# EAGLE design GBz (EAGLE 7.7.0)
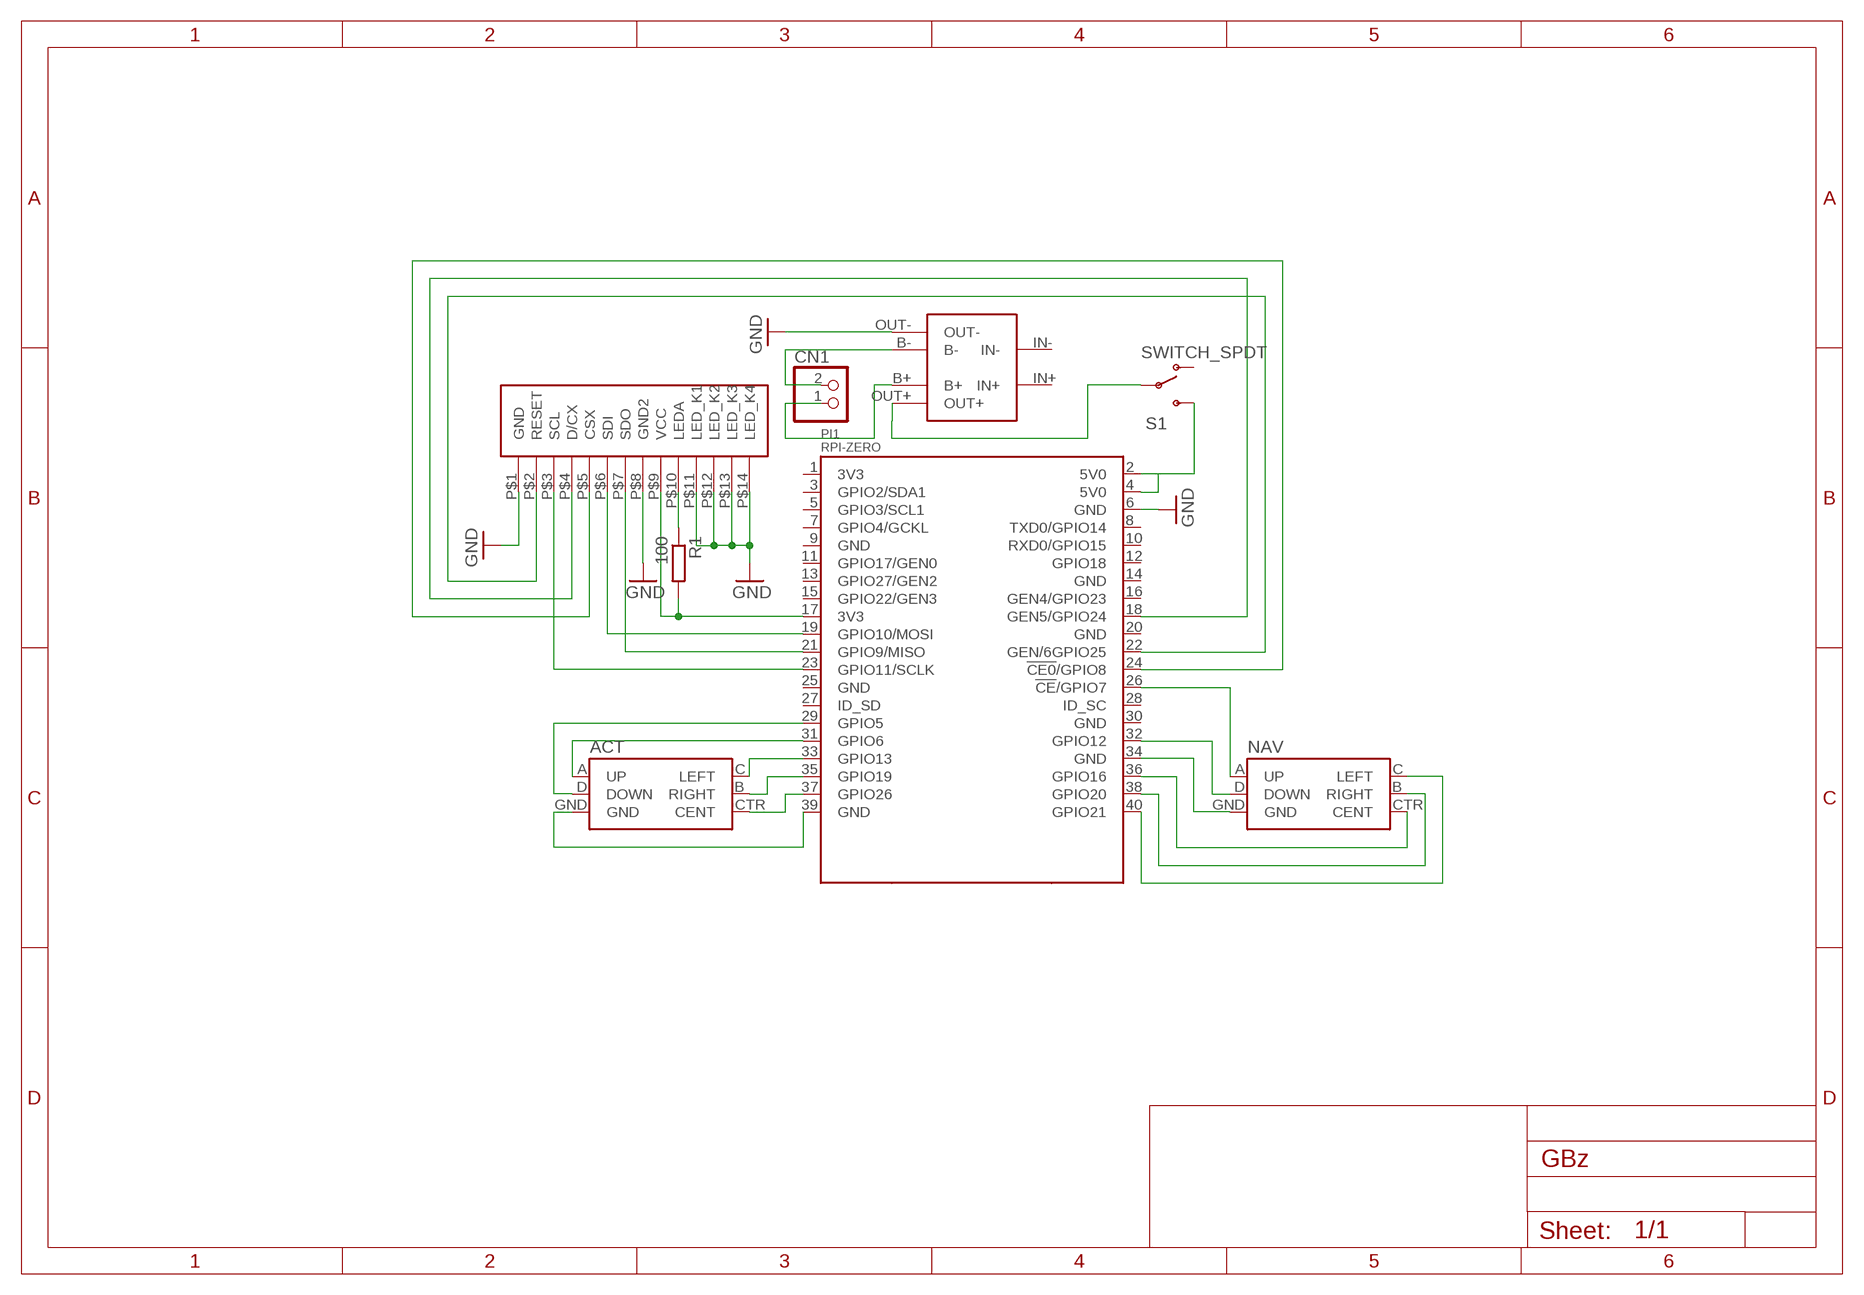
[diagram p0: schematic, sheet 1]

## Parts
ACT  JOYSTICK_MINI  [JOYSTICK_MINI]
CN1  JST_2PIN-SMT-RA  [JST-PH-2-SMT-RA]
NAV  JOYSTICK_MINI  [JOYSTICK_MINI]
PI1  RPI-ZERO  [RASPBERRYPI_BASTELSTUBE_V13_RASPI_BOARD_B+_FULL]
POWER1  03962A  [03962A]
R1  100  R-EU_R0805  [R0805]
S1  SWITCH_SPDT  [KPS-1290]
SCREEN1  ILI9341-2.2  [ILI9341-2.2]

## Nets
5V0@2: PI1.2(5V0) PI1.4(5V0) S1.S
GND: PI1.6(GND) POWER1.OUT- SCREEN1.P$1(GND) SCREEN1.P$8(GND2) SCREEN1.P$11(LED_K1) SCREEN1.P$12(LED_K2) SCREEN1.P$13(LED_K3) SCREEN1.P$14(LED_K4)
GND@3: ACT.GND PI1.39(GND)
GND@7: NAV.GND PI1.34(GND)
N$1: PI1.22(GEN/6GPIO25) SCREEN1.P$2(RESET)
N$2: PI1.23(GPIO11/SCLK) SCREEN1.P$3(SCL)
N$3: PI1.19(GPIO10/MOSI) SCREEN1.P$6(SDI)
N$4: PI1.21(GPIO9/MISO) SCREEN1.P$7(SDO)
N$5: R1.1 SCREEN1.P$10(LEDA)
N$6: PI1.18(GEN5/GPIO24) SCREEN1.P$4(D/CX)
N$7: PI1.24(!CE0!/GPIO8) SCREEN1.P$5(CSX)
N$8: NAV.CTR(CENT) PI1.36(GPIO16)
N$9: ACT.CTR(CENT) PI1.37(GPIO26)
N$10: ACT.B(RIGHT) PI1.35(GPIO19)
N$11: ACT.C(LEFT) PI1.33(GPIO13)
N$12: ACT.A(UP) PI1.31(GPIO6)
N$13: ACT.D(DOWN) PI1.29(GPIO5)
N$14: NAV.B(RIGHT) PI1.38(GPIO20)
N$15: NAV.C(LEFT) PI1.40(GPIO21)
N$16: CN1.1 POWER1.B+
N$17: NAV.D(DOWN) PI1.32(GPIO12)
N$18: NAV.A(UP) PI1.26(!CE!/GPIO7)
N$19: PI1.17(3V3) R1.2 SCREEN1.P$9(VCC)
N$21: CN1.2 POWER1.B-
N$24: POWER1.OUT+ S1.P
Unconnected: PI1.1(3V3) PI1.3(GPIO2/SDA1) PI1.5(GPIO3/SCL1) PI1.7(GPIO4/GCKL) PI1.8(TXD0/GPIO14) PI1.9(GND) PI1.10(RXD0/GPIO15) PI1.11(GPIO17/GEN0) PI1.12(GPIO18) PI1.13(GPIO27/GEN2) PI1.14(GND) PI1.15(GPIO22/GEN3) PI1.16(GEN4/GPIO23) PI1.20(GND) PI1.25(GND) PI1.27(ID_SD) PI1.28(ID_SC) PI1.30(GND) POWER1.IN+ POWER1.IN- S1.O

## Library data of the parts
ACT NAV = SparkFun-Electromechanical:JOYSTICK_MINI: Small 5-way tactile joystick, COM-10063 4UCON SF303GJ26; PROD_ID: SWCH-09905
CN1 = adafruit:JST_2PIN: JST 2-Pin Connectors of various flavors SMT-RA (S2B-PH-SM4) 4UConnector #17311 SMT (B2B-PH-SM4) THM-RA (S2B-PH) THM (B2B-PH)
PI1 = RPI-Zero:RPI-ZERO
POWER1 = 03962A:03962A
R1 = resistor:R-EU_: RESISTOR, European symbol
S1 = SparkFun-Electromechanical:SWITCH_SPDT: SWCH-10651 Side-actuated SPDT slide switch, as used on the Arduino Pro; PROD_ID: SWCH-10651
SCREEN1 = ili9341:ILI9341-2.2

## Board
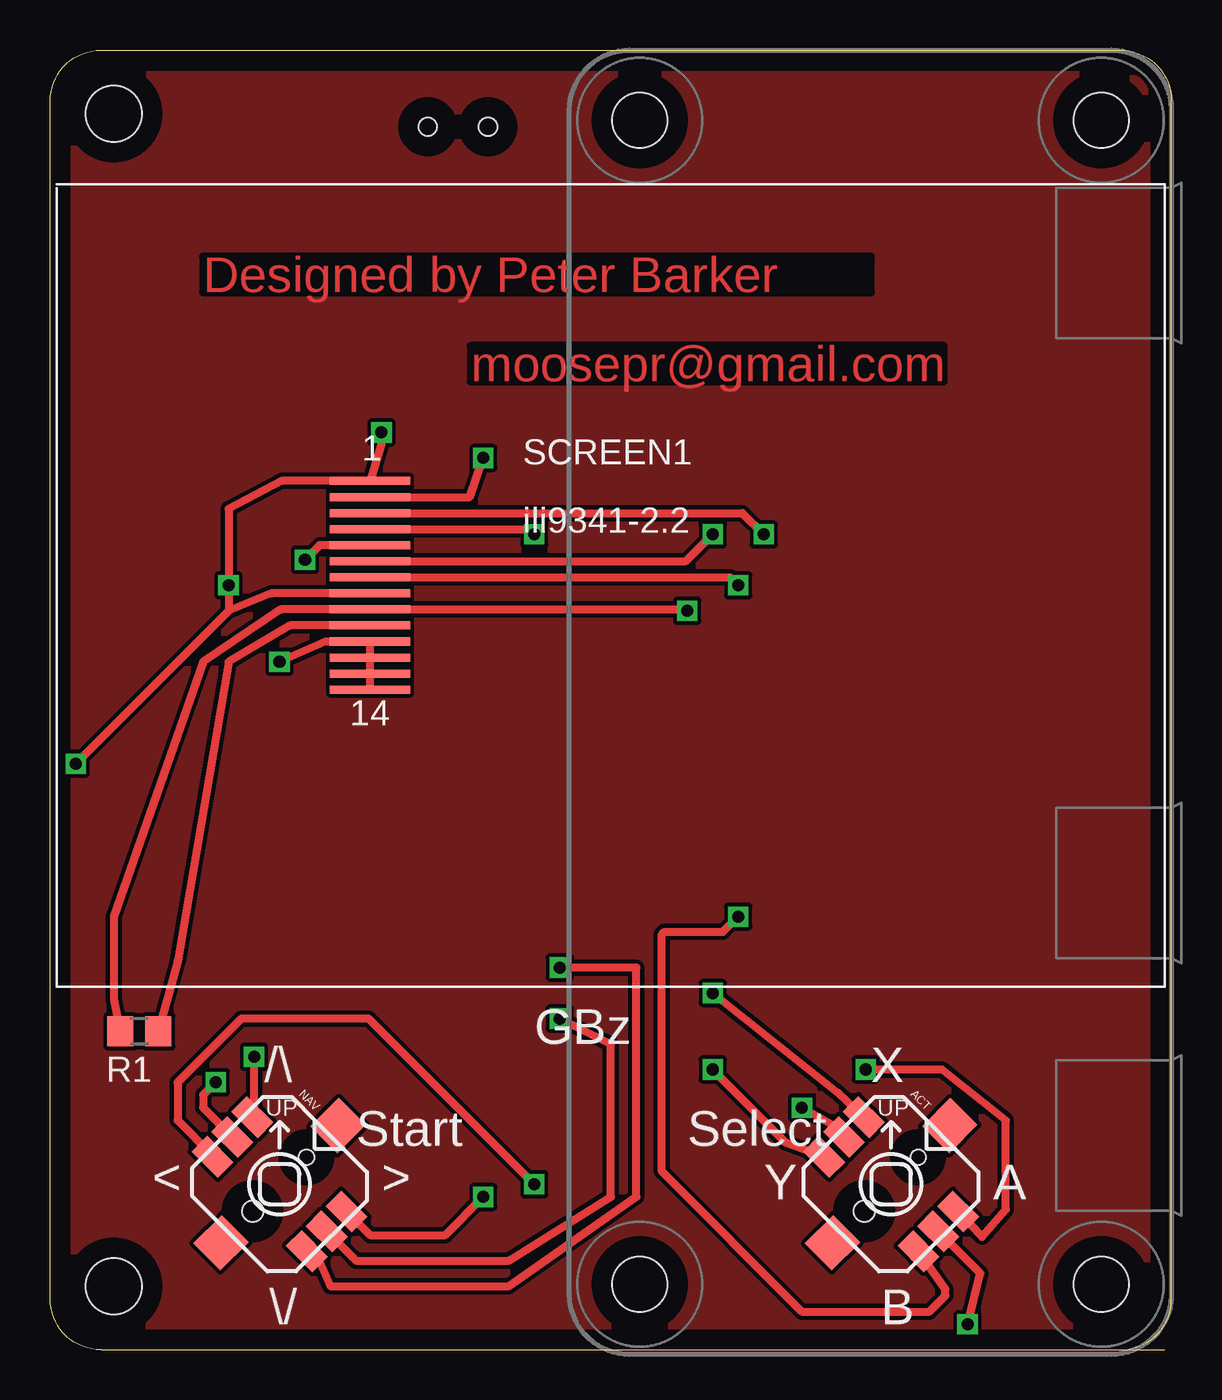
[diagram p1: board, top side]
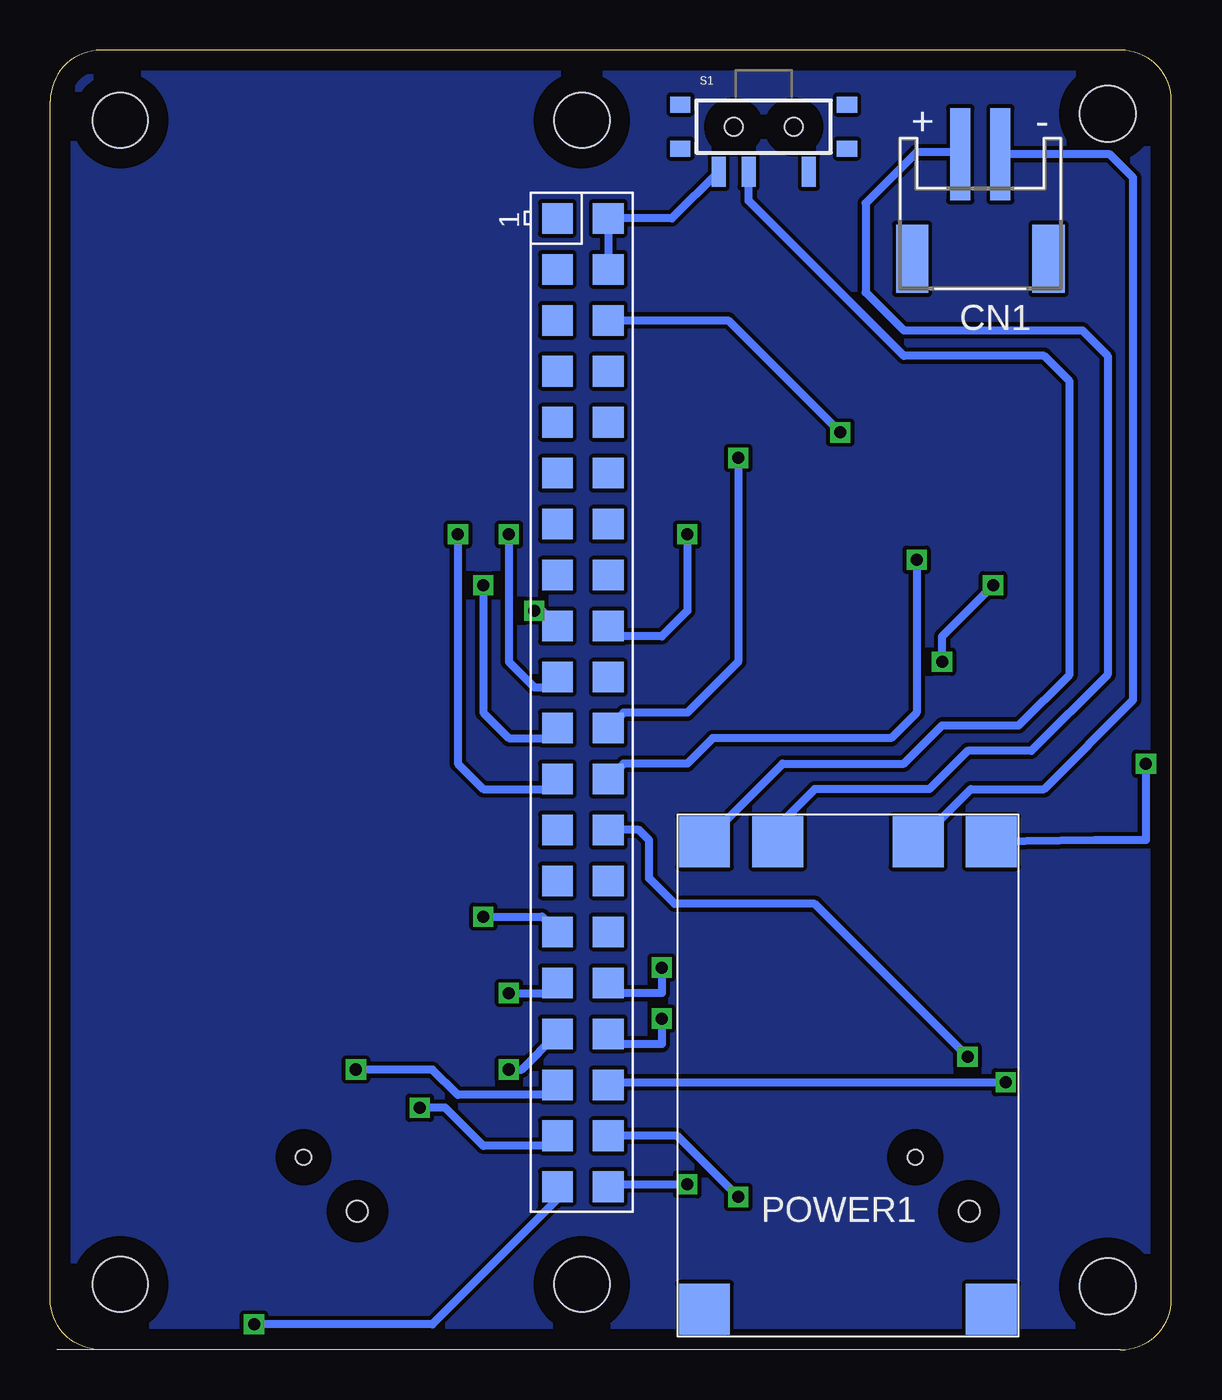
[diagram p2: board, bottom side, seen from below]

Size 55.88 x 64.77 mm. Coordinates in mm from the lower left corner, seen from the top.
Outline: 53.34,0 2.54,0 arc-90 0,2.54 0,62.23 arc-90 2.54,64.77 53.34,64.77 arc-90 55.88,62.23 55.88,2.54 arc-90 53.34,0
Outline: 53.34,0 55.55,0
Copper layers (1*16): Top 0.035mm / dielectric 1.5mm / Bottom 0.035mm
Design rules "default": minimum track width 10mil, minimum drill 24mil, track to track 8mil, track to pad 8mil, pad to pad 8mil, via to via 8mil, smd to smd 8mil, copper to edge 40mil, drill to drill 8mil, minimum pad ring 10mil, minimum via ring 8mil, stop-mask expansion 4mil, vias tented up to drill 0mil, thermal gap 10mil
Holes 2.8 mm at 3.18,61.59 3.18,3.18

### Footprints (pad centres in the part's own frame; a part is rotated, then mirrored left to right if it is on the bottom)
JOYSTICK_MINI = smd 1.85 x 1.1: A -3.325,1.4; B 3.325,1.4; C -3.325,-1.4; CTR -3.325,0; D 3.325,-1.4; GND 3.325,0 | smd 1.9 x 2: NC 0,4.13; NC@0 0,-4.13 | hole 0.75: 0,1.9 | hole 1.05: 0,-1.9
JST-PH-2-SMT-RA = smd 1 x 4.6: 1 1,-3.7; 2 -1,-3.7 | smd 1.6 x 3.4: NC1 -3.4,1.5; NC2 3.4,1.5
RASPBERRYPI_BASTELSTUBE_V13_RASPI_BOARD_B+_FULL = smd 1.524 x 1.524: 1 8.382,25.273; 2 8.382,27.813; 3 10.922,25.273; 4 10.922,27.813; 5 13.462,25.273; 6 13.462,27.813; 7 16.002,25.273; 8 16.002,27.813; 9 18.542,25.273; 10 18.542,27.813; 11 21.082,25.273; 12 21.082,27.813; 13 23.622,25.273; 14 23.622,27.813; 15 26.162,25.273; 16 26.162,27.813; 17 28.702,25.273; 18 28.702,27.813; 19 31.242,25.273; 20 31.242,27.813; 21 33.782,25.273; 22 33.782,27.813; 23 36.322,25.273; 24 36.322,27.813; 25 38.862,25.273; 26 38.862,27.813; 27 41.402,25.273; 28 41.402,27.813; 29 43.942,25.273; 30 43.942,27.813; 31 46.482,25.273; 32 46.482,27.813; 33 49.022,25.273; 34 49.022,27.813; 35 51.562,25.273; 36 51.562,27.813; 37 54.102,25.273; 38 54.102,27.813; 39 56.642,25.273; 40 56.642,27.813 | hole 2.75: 3.5,3.5; 3.5,26.5; 61.5,3.5; 61.5,26.5
03962A = smd 2.54 x 2.54: B+ 12,1.35; B- 5,1.35; IN+ 15.65,24.65; IN- 1.35,24.65; OUT+ 15.65,1.35; OUT- 1.35,1.35
R0805 = smd 1.3 x 1.5: 1 -0.95,0; 2 0.95,0
KPS-1290 = smd 0.7 x 1.5: O -2.25,2.25; P 0.75,2.25; S 2.25,2.25 | smd 1 x 0.8: P$1 -4.15,1.1; P$2 -4.15,-1.1; P$3 4.15,-1.1; P$4 4.15,1.1 | hole 0.9: -1.5,0; 1.5,0
ILI9341-2.2 = smd 4 x 0.4: P$1 -12,5.2; P$2 -12,4.4; P$3 -12,3.6; P$4 -12,2.8; P$5 -12,2; P$6 -12,1.2; P$7 -12,0.4; P$8 -12,-0.4; P$9 -12,-1.2; P$10 -12,-2; P$11 -12,-2.8; P$12 -12,-3.6; P$13 -12,-4.4; P$14 -12,-5.2

### Placement (x,y rotation side)
ACT  41.91,8.26 315 top
CN1  9.53,55.88 180 bottom
NAV  11.43,8.26 315 top
PI1  55.88,64.77 270 bottom
POWER1  7.62,26.67 180 bottom
R1  4.45,15.88 180 top
S1  20.32,60.96 180 bottom
SCREEN1  27.94,38.1 0 top

### Tracks (layer width: path | path; a pad name or v marks a point on that pad's centre or on a via)
5V0@2
  Bottom 0.406: S1.S 24.89,56.39 PI1.2 PI1.4
GND  (via drill 0.6)
  Top 0.406: v16.51,45.72 16.51,45.14 SCREEN1.P$1 11.55,43.3 8.89,41.91 v8.89,38.1 8.89,36.83 | SCREEN1.P$14 SCREEN1.P$13 SCREEN1.P$12 SCREEN1.P$11 13.71,35.3 v11.43,34.29 | SCREEN1.P$8 11.03,37.7 8.89,36.83 | 8.89,36.83 v1.27,29.21
  Bottom 0.406: PI1.6 22.1,51.31 v16.51,45.72 | v1.27,29.21 1.27,25.4 3.81,25.4 POWER1.OUT- | v11.43,34.29 11.43,35.56 v8.89,38.1
GND@3  (via drill 0.6)
  Top 0.406: v45.72,1.27 46.35,3.81 ACT.GND
  Bottom 0.406: PI1.39 30.61,7.49 36.83,1.27 v45.72,1.27
GND@7  (via drill 0.6)
  Top 0.406: NAV.GND 15.05,4.63 15.24,4.45 22.86,4.45 27.94,7.62 27.94,15.24 v25.4,16.51
  Bottom 0.406: v25.4,16.51 25.4,15.24 27.56,15.24 PI1.34
N$1  (via drill 0.6)
  Top 0.406: SCREEN1.P$2 20.91,42.5 v21.59,44.45
  Bottom 0.406: v21.59,44.45 21.59,34.29 24.13,31.75 27.3,31.75 PI1.22
N$2  (via drill 0.6)
  Top 0.406: SCREEN1.P$3 34.5,41.7 v35.56,40.64
  Bottom 0.406: v35.56,40.64 35.56,29.21 34.29,27.94 31.11,27.94 PI1.23
N$3  (via drill 0.6)
  Top 0.406: SCREEN1.P$6 31.68,39.3 v33.02,40.64
  Bottom 0.406: v33.02,40.64 33.02,34.29 31.75,33.02 31.11,33.02 PI1.19
N$4  (via drill 0.6)
  Top 0.406: SCREEN1.P$7 33.89,38.5 v34.29,38.1
  Bottom 0.406: v34.29,38.1 34.29,31.75 33.02,30.48 31.11,30.48 PI1.21
N$5
  Top 0.406: SCREEN1.P$10 11.97,36.1 8.89,34.29 6.35,19.37 R1.1
N$6  (via drill 0.6)
  Top 0.406: SCREEN1.P$4 23.87,40.9 v24.13,40.64
  Bottom 0.406: v24.13,40.64 24.13,36.83 25.4,35.56 27.56,35.56 PI1.18
N$7  (via drill 0.6)
  Top 0.406: SCREEN1.P$5 13.43,40.1 v12.7,39.37
  Bottom 0.406: v12.7,39.37 12.7,31.75 13.97,30.48 22.86,30.48 24.13,29.21 27.3,29.21 PI1.24
N$8  (via drill 0.6)
  Top 0.406: v8.26,13.34 7.62,12.7 7.62,12.07 NAV.CTR | NAV.CTR
  Bottom 0.406: PI1.36 27.94,13.34 v8.26,13.34
N$9  (via drill 0.6)
  Top 0.406: ACT.CTR 38.92,11.24 v37.46,12.07
  Bottom 0.406: PI1.37 31.11,10.16 34.29,10.16 36.2,12.07 v37.46,12.07
N$10  (via drill 0.6)
  Top 0.406: ACT.B 46.45,5.62 47.62,6.99 47.62,11.43 44.45,13.97 v40.64,13.97
  Bottom 0.406: PI1.35 31.11,12.7 35.56,12.7 36.83,13.97 v40.64,13.97
N$11  (via drill 0.6)
  Top 0.406: ACT.C 36.66,10.33 v33.02,13.97
  Bottom 0.406: v33.02,13.97 32.38,13.97 PI1.33
N$12  (via drill 0.6)
  Top 0.406: ACT.A 39.28,12.79 v33.02,17.78
  Bottom 0.406: v33.02,17.78 31.11,17.78 PI1.31
N$13  (via drill 0.6)
  Top 0.406: ACT.D 44.62,3.01 44.62,2.71 43.81,1.9 37.46,1.9 30.48,8.89 30.48,20.7 PI1.29 33.53,20.83 v34.29,21.59
  Bottom 0.406: v34.29,21.59 31.37,21.59 PI1.29
N$14  (via drill 0.6)
  Top 0.406: NAV.B 15.95,5.71 19.68,5.71 v21.59,7.62
  Bottom 0.406: v21.59,7.62 24.64,10.67 PI1.38
N$15  (via drill 0.6)
  Top 0.406: v24.13,8.26 15.88,16.51 9.53,16.51 6.35,13.34 6.35,11.43 8.09,9.69 NAV.C
  Bottom 0.406: PI1.40 27.94,8.26 v24.13,8.26
N$16
  Bottom 0.406: CN1.1 10.63,59.69 12.7,59.69 15.24,57.15 15.24,52.7 13.34,50.8 4.45,50.8 3.18,49.53 3.18,33.65 6.99,29.84 10.16,29.84 12.07,27.94 17.78,27.94 19.62,26.1 POWER1.B+
N$17  (via drill 0.6)
  Top 0.406: NAV.D 13.43,4.35 13.97,3.18 22.86,3.18 29.21,7.62 29.21,19.05 v25.4,19.05
  Bottom 0.406: v25.4,19.05 25.4,17.78 27.56,17.78 PI1.32
N$18  (via drill 0.6)
  Top 0.406: NAV.A 10.16,11.69 v10.16,14.61
  Bottom 0.406: v10.16,14.61 17.78,22.23 24.77,22.23 26.04,23.5 26.04,25.4 26.54,25.91 PI1.26
N$19  (via drill 0.6)
  Top 0.406: R1.2 3.18,17.46 3.18,21.59 7.62,34.29 11.5,36.9 SCREEN1.P$9 31.68,36.9 v31.75,36.83
  Bottom 0.406: v31.75,36.83 31.37,36.83 PI1.17
N$21
  Bottom 0.406: POWER1.B- 10,27.94 6.35,27.94 1.9,32.38 1.9,58.42 3.06,59.58 CN1.2
N$22
  pour Top: 0,64.77 55.88,64.77 55.88,0 0,0
N$23
  pour Bottom: 0,64.77 55.88,64.77 55.88,0 0,0
N$24
  Bottom 0.406: POWER1.OUT+ 19.38,29.21 13.34,29.21 11.43,31.11 7.62,31.11 5.08,33.65 5.08,48.26 6.35,49.53 13.34,49.53 21.07,57.26 S1.P

### Text on the board
Top: Designed by Peter Barker | moosepr@gmail.com
tNames: GBz | /\\ | X | Start | Select | < | > | Y | A | \\/ | B